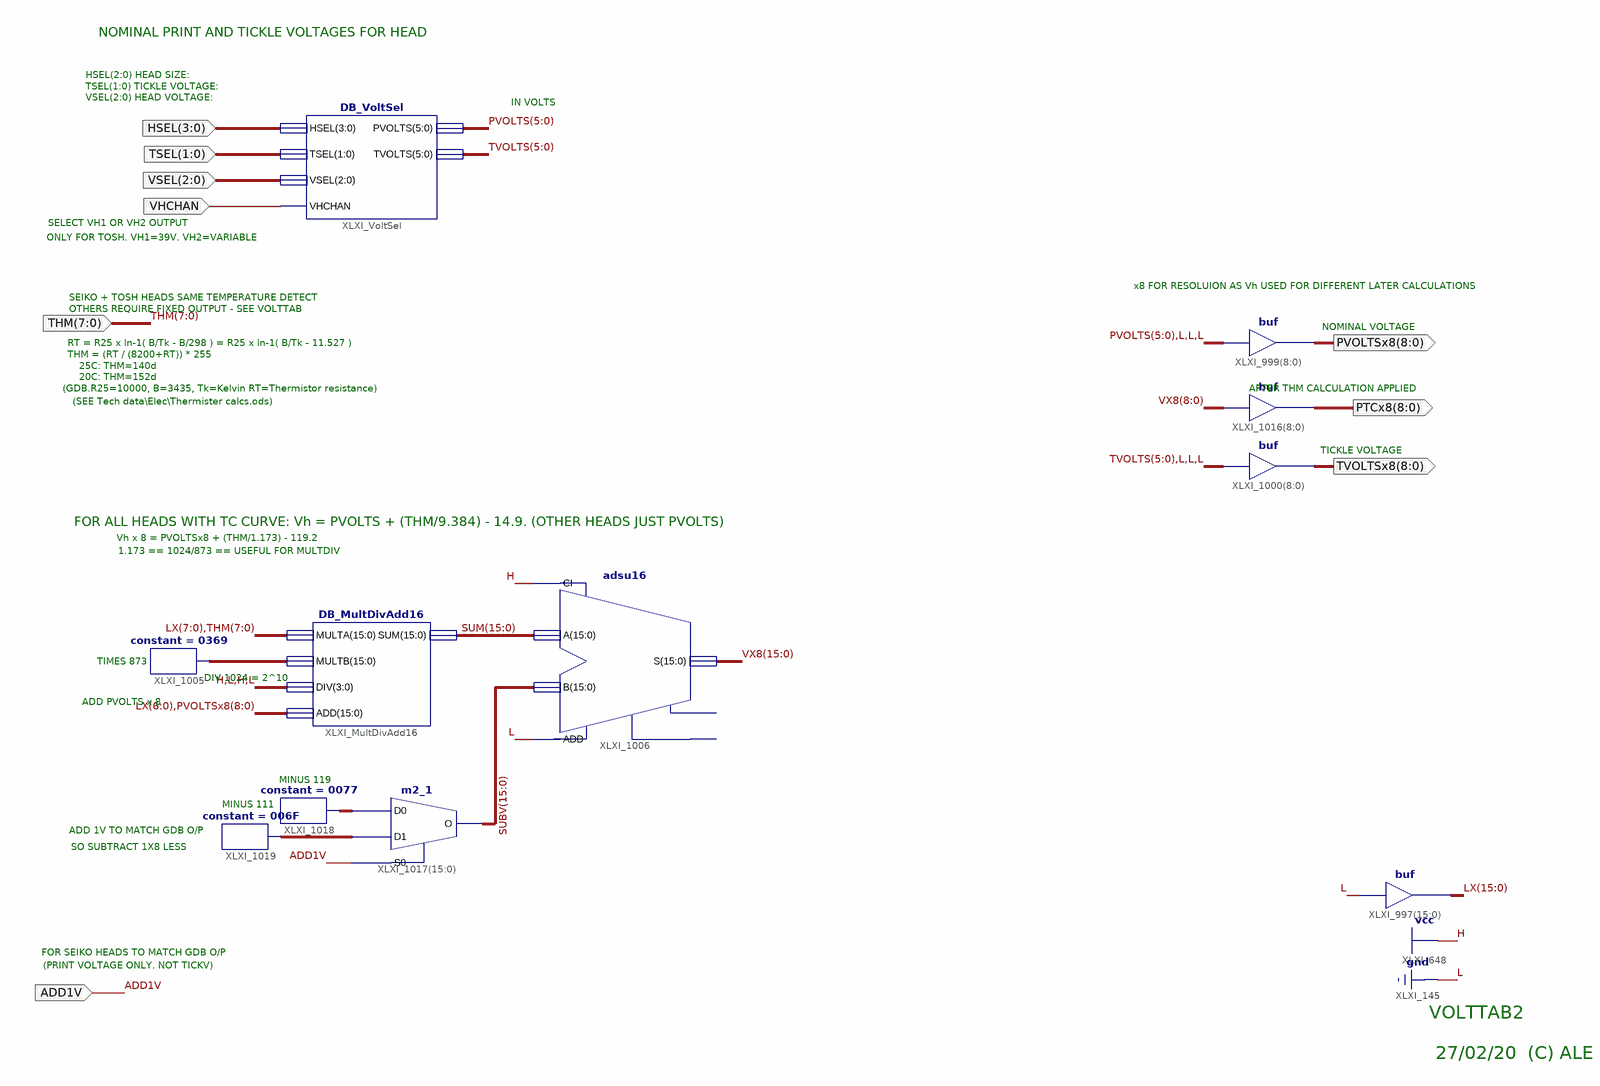
[diagram p0: schematic sheet 1]
// Xilinx ISE schematic DB_VoltTab2.sch (spartan3e) as structural Verilog: 11 symbols, 9 ports
module DB_VoltTab2 (
  input  [3:0] HSEL,
  input  [2:0] VSEL,
  input  [1:0] TSEL,
  input  VHCHAN,
  input  [7:0] THM,
  input  ADD1V,
  output [8:0] PTCx8,
  output [8:0] TVOLTSx8,
  output [8:0] PVOLTSx8
);

  wire [5:0] PVOLTS, TVOLTS;
  wire [15:0] LX, SUBV, SUM, VX8, XLXN_35, XLXN_43, XLXN_44;

  assign LX = {16{1'b0}};  // buf XLXI_997[15..0], 16 bits wide
  assign PVOLTSx8 = {PVOLTS, 3'b000};  // buf XLXI_999[8..0], 9 bits wide
  assign TVOLTSx8 = {TVOLTS, 3'b000};  // buf XLXI_1000[8..0], 9 bits wide
  DB_VoltSel XLXI_VoltSel (.HSEL(HSEL), .PVOLTS(PVOLTS), .TSEL(TSEL), .TVOLTS(TVOLTS), .VHCHAN(VHCHAN), .VSEL(VSEL));
  DB_MultDivAdd16 XLXI_MultDivAdd16 (
    .ADD({LX[6:0], PVOLTSx8}), .DIV(4'b1010), .MULTA({LX[7:0], THM}), .MULTB(XLXN_35), .SUM(SUM));
  constant #(.CValue("0369")) XLXI_1005 (.O(XLXN_35));
  adsu16 XLXI_1006 (.A(SUM), .ADD(1'b0), .B(SUBV), .CI(1'b1), .S(VX8));  // open: CO, OFL
  assign PTCx8 = VX8[8:0];  // buf XLXI_1016[8..0], 9 bits wide
  constant #(.CValue("0077")) XLXI_1018 (.O(XLXN_43));
  constant #(.CValue("006F")) XLXI_1019 (.O(XLXN_44));
  m2_1 XLXI_1017[15:0] (.D0(XLXN_43), .D1(XLXN_44), .S0(ADD1V), .O(SUBV));

  // Notes on the sheet:
  //   NOMINAL PRINT AND TICKLE VOLTAGES FOR HEAD
  //   HSEL(2:0) HEAD SIZE:
  //   TSEL(1:0) TICKLE VOLTAGE:
  //   VSEL(2:0) HEAD VOLTAGE:
  //   IN VOLTS
  //   SELECT VH1 OR VH2 OUTPUT
  //   ONLY FOR TOSH. VH1=39V. VH2=VARIABLE
  //   x8 FOR RESOLUION AS Vh USED FOR DIFFERENT LATER CALCULATIONS
  //   SEIKO + TOSH HEADS SAME TEMPERATURE DETECT
  //   OTHERS REQUIRE FIXED OUTPUT - SEE VOLTTAB
  //   NOMINAL VOLTAGE
  //   RT = R25 x ln-1( B/Tk - B/298 ) = R25 x ln-1( B/Tk - 11.527 )
  //   THM = (RT / (8200+RT)) * 255
  //   25C: THM=140d
  //   20C: THM=152d
  //   (GDB.R25=10000, B=3435, Tk=Kelvin RT=Thermistor resistance)
  //   AFTER THM CALCULATION APPLIED
  //   (SEE Tech data\Elec\Thermister calcs.ods)
  //   TICKLE VOLTAGE
  //   FOR ALL HEADS WITH TC CURVE: Vh = PVOLTS + (THM/9.384) - 14.9. (OTHER HEADS JUST PVOLTS)
  //   Vh x 8 = PVOLTSx8 + (THM/1.173) - 119.2
  //   1.173 == 1024/873 == USEFUL FOR MULTDIV
  //   TIMES 873
  //   DIV 1024 = 2^10
  //   ADD PVOLTS x 8
  //   MINUS 119
  //   MINUS 111
  //   ADD 1V TO MATCH GDB O/P
  //   SO SUBTRACT 1X8 LESS
  //   FOR SEIKO HEADS TO MATCH GDB O/P
  //   (PRINT VOLTAGE ONLY. NOT TICKV)
  //   VOLTTAB2
  //   27/02/20  (C) ALE
endmodule
